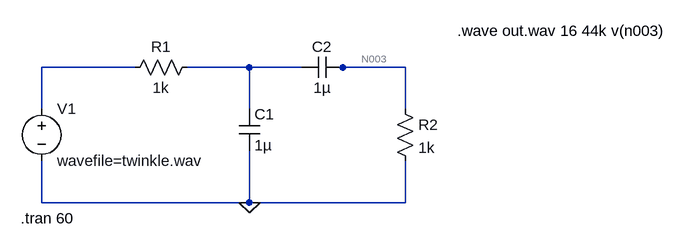
[diagram p0: schematic ex12.asc]
ex12.asc, the LTspice schematic file:
Version 4
SHEET 1 1052 680
WIRE 224 96 80 96
WIRE 400 96 304 96
WIRE 480 96 400 96
WIRE 544 96 528 96
WIRE 640 96 544 96
WIRE 80 160 80 96
WIRE 400 160 400 96
WIRE 640 160 640 96
WIRE 80 304 80 240
WIRE 400 304 400 224
WIRE 400 304 80 304
WIRE 640 304 640 240
WIRE 640 304 400 304
FLAG 400 304 0
SYMBOL cap 384 160 R0
SYMATTR InstName C1
SYMATTR Value 1µ
SYMBOL cap 480 112 R270
WINDOW 0 32 32 VTop 2
WINDOW 3 0 32 VBottom 2
SYMATTR InstName C2
SYMATTR Value 1µ
SYMBOL voltage 80 144 R0
WINDOW 123 0 0 Left 2
WINDOW 39 0 0 Left 2
SYMATTR InstName V1
SYMATTR Value wavefile=twinkle.wav
SYMBOL res 208 112 R270
WINDOW 0 32 56 VTop 2
WINDOW 3 0 56 VBottom 2
SYMATTR InstName R1
SYMATTR Value 1k
SYMBOL res 624 144 R0
SYMATTR InstName R2
SYMATTR Value 1k
TEXT 48 328 Left 2 !.tran 60
TEXT 720 40 Left 2 !.wave out.wav 16 44k v(n003)

The netlist it stands for:
* ex12.asc
C1 N002 0 1µ
C2 N002 N003 1µ
V1 N001 0 wavefile=twinkle.wav
R1 N001 N002 1k
R2 N003 0 1k
.tran 60
.wave out.wav 16 44k v(n003)
.backanno
.end